# Altium schematic sheet Controller.SchDoc
size A4; SheetNumber: 1; SheetTotal: 3
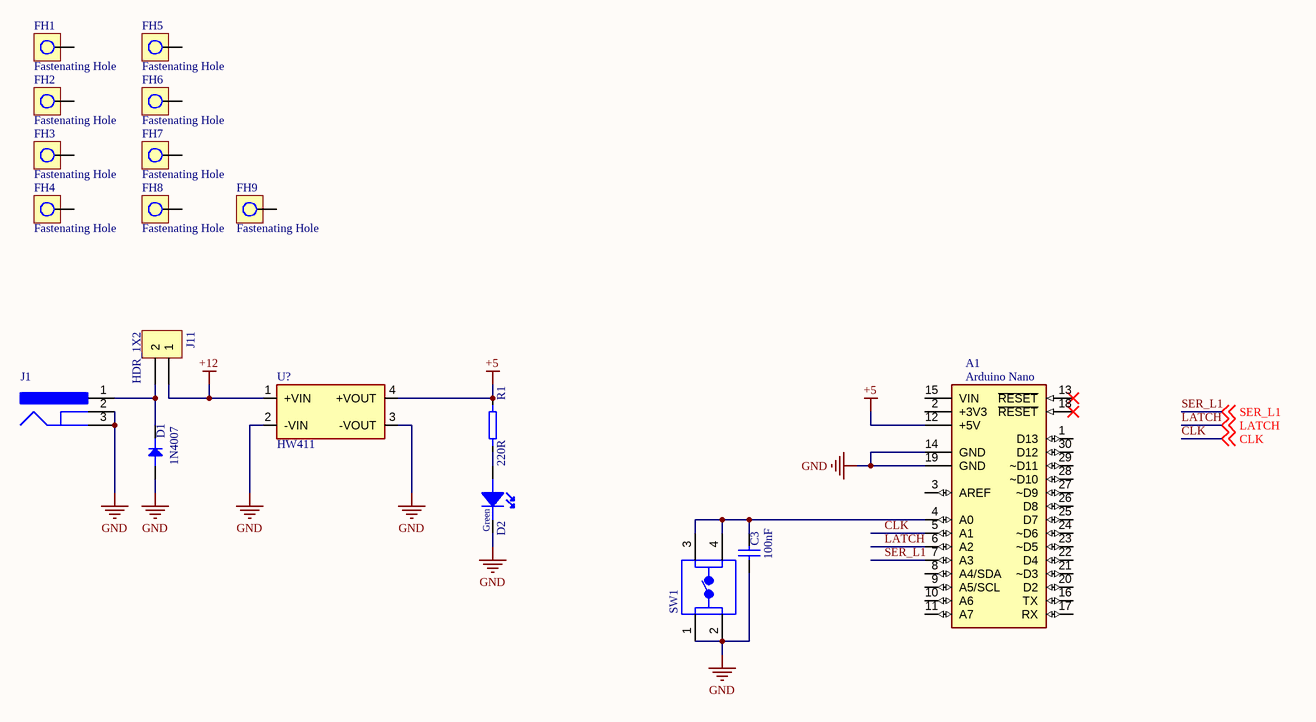
[diagram p0: Controller.SchDoc]

## Parts
A1  Arduino Nano  [Arduino_Nano]
C3  Capacitance: 100nF  [CAP_CER_2.5MM]  (hidden comment: C 100nF)
D1  1N4007  [D_Axial_0.4]
D2  Green  [LED_5MM]
FH1  Fastenating Hole  [FH_3MM]
FH2  Fastenating Hole  [FH_3MM]
FH3  Fastenating Hole  [FH_3MM]
FH4  Fastenating Hole  [FH_3MM]
FH5  Fastenating Hole  [FH_3MM]
FH6  Fastenating Hole  [FH_3MM]
FH7  Fastenating Hole  [FH_3MM]
FH8  Fastenating Hole  [FH_3MM]
FH9  Fastenating Hole  [FH_3MM]
J1  PJ-002A  [DC_JACK_RA_2.1mm]  (value not drawn)
J11  HDR_1X2  [HDR_1X2_5.08MM]  (no BOM)
R1  220R  [R_AXIAL_0.3MM]
SW1  Pb 6x4mm  [PB_6x4mm]  (value not drawn)
U?  HW411  [HW-411]

## Nets
+5: A1.12(+5V) R1.1 U?.4(+VOUT)
+12: J11.1 U?.1(+VIN)
GND: A1.14(GND) A1.19(GND) C3.1 D1.A D2.2(K) J1.2 J1.3 SW1.1 SW1.2 U?.2(-VIN) U?.3(-VOUT)
CLK: A1.5(A1) ; off-sheet CLK
LATCH: A1.6(A2) ; off-sheet LATCH
SER_L1: A1.7(A3) ; off-sheet SER_L1
NetA1_4: A1.4(A0) C3.2 SW1.3 SW1.4
NetD1_K: D1.K J1.1 J11.2
NetD2_1: D2.1(A) R1.2

Not connected (* = marked no-connect by the designer): A1 1(D13) 2(+3V3) 3(AREF) 8(A4/SDA) 9(A5/SCL) 10(A6) 11(A7) 13(~{RESET})* 15(VIN) 16(TX) 17(RX) 18(~{RESET})* 20(D2) 21(~D3) 22(D4) 23(~D5) 24(~D6) 25(D7) 26(D8) 27(~D9) 28(~D10) 29(~D11) 30(D12); FH1 1; FH2 1; FH3 1; FH4 1; FH5 1; FH6 1; FH7 1; FH8 1; FH9 1

## Notes on the sheet
- Title:
- Page:
- Date:
- Time:
- DWG NO.
- Author:
- REV NO.
- Omar Elsobkey
- Sheet       of
- Variant:
- A4
- Size
- Address:
- File:

## Library data of the parts
C3 = C 100nF: Ceramic Cap. 100nF; MF: Murata; MP: RDE5C2A220J0M1H03A; Availability: Unavailable; Price: None; Package: Radial Murata; SnapEDA_Link: https://www.snapeda.com/parts/RDE5C2A220J0M1H03A/Murata/view-part/4545539/?ref=snap
D2 = LED G
FH1-FH9 = FH
J1 = DC Jack F 2.lmm: Through Hole Right Angle DC Power Jack, 2.5 A, 2 mm Center Pin, 3 Position, -25 to 85 degC, RoHS, Bulk
J11 = HDR_1X2_5.08mm_1: On/Off SW; ComponentLink1Description: Supplying Link; Supplier: Makers Electronics
R1 = R 220